# Altium schematic sheet TTLclock.SchDoc
size 558 x 431 mm; SheetNumber: 1; SheetTotal: 1
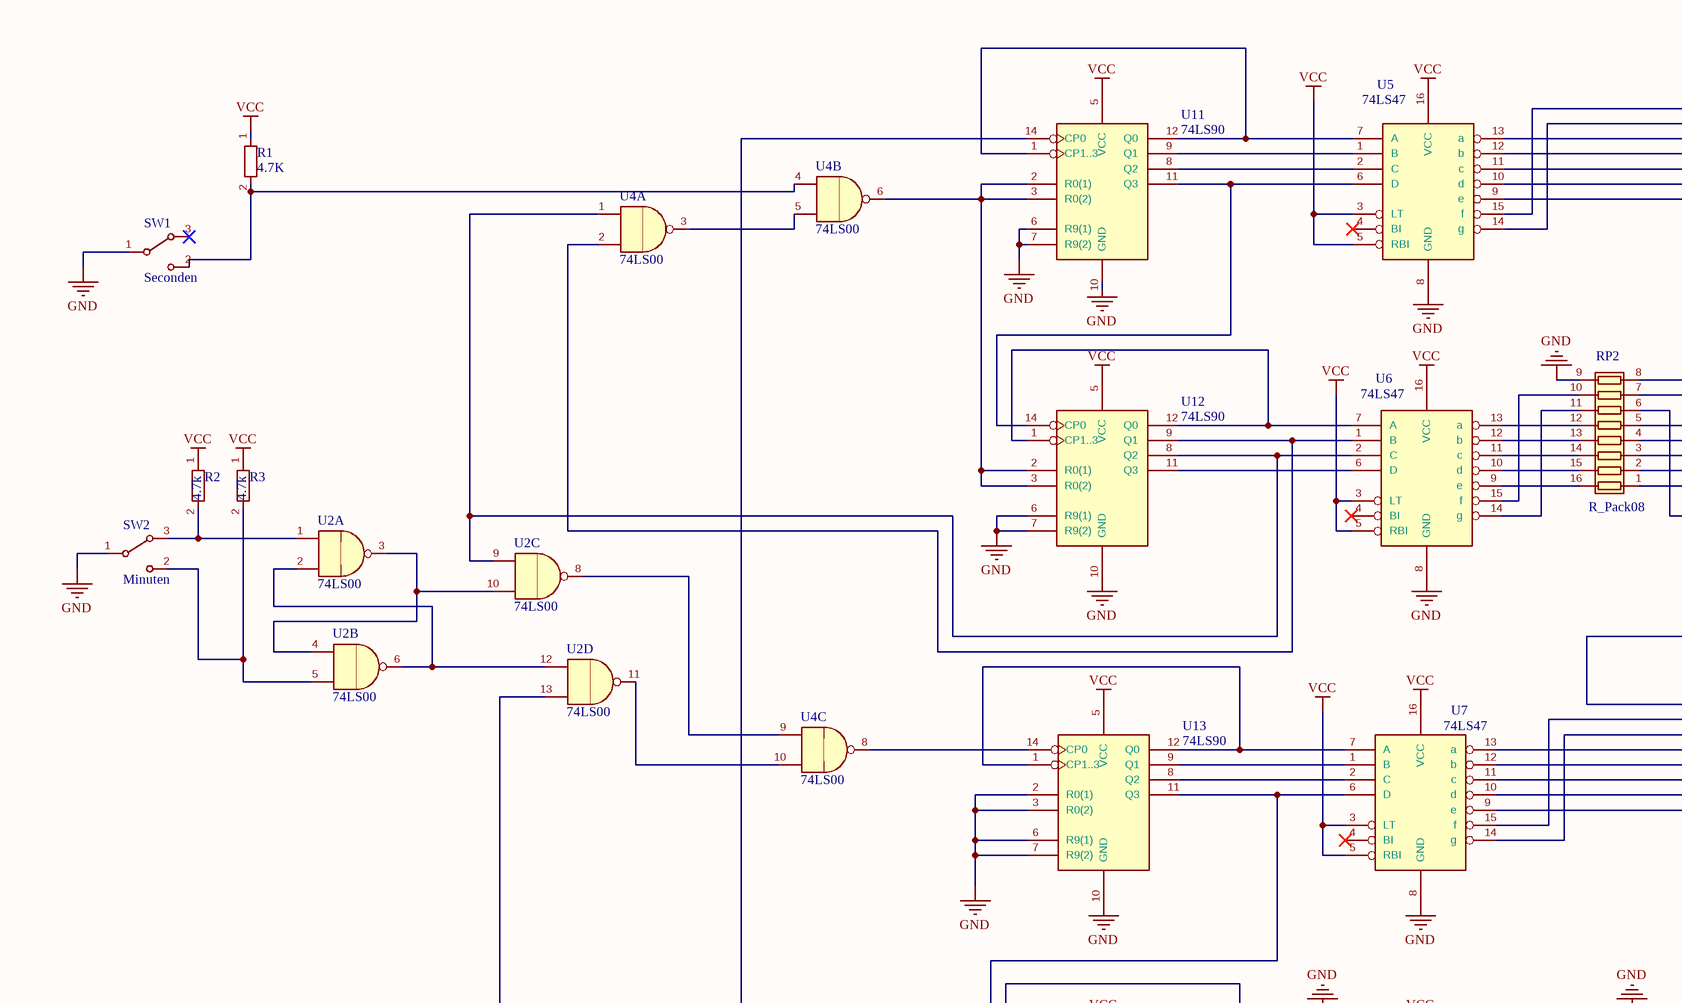
[diagram p0: TTLclock.SchDoc, top left]
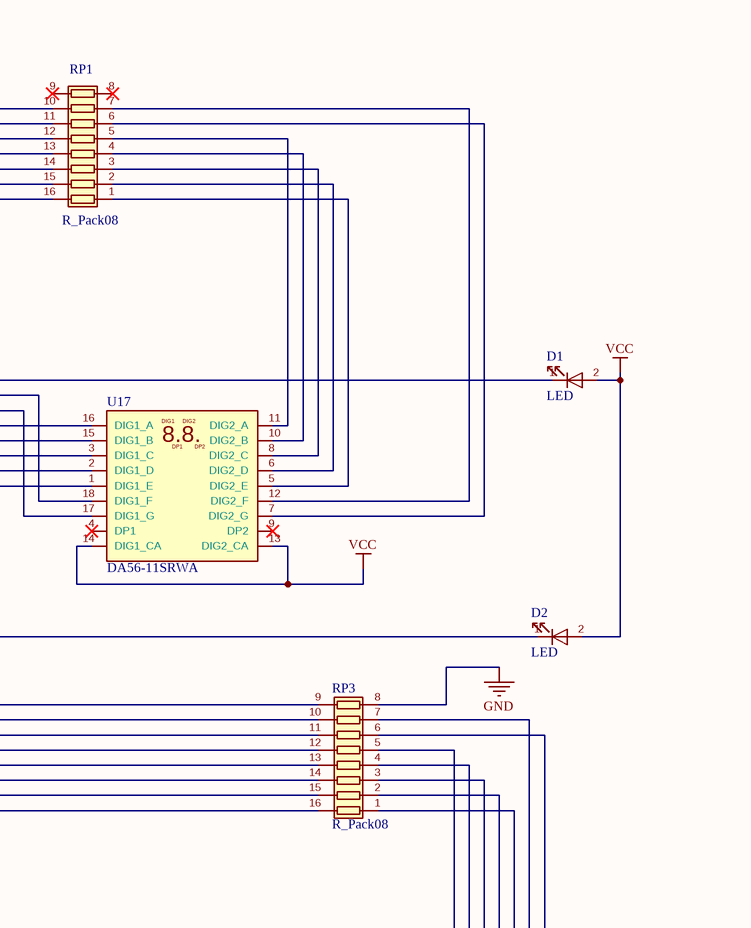
[diagram p1: TTLclock.SchDoc, top right]
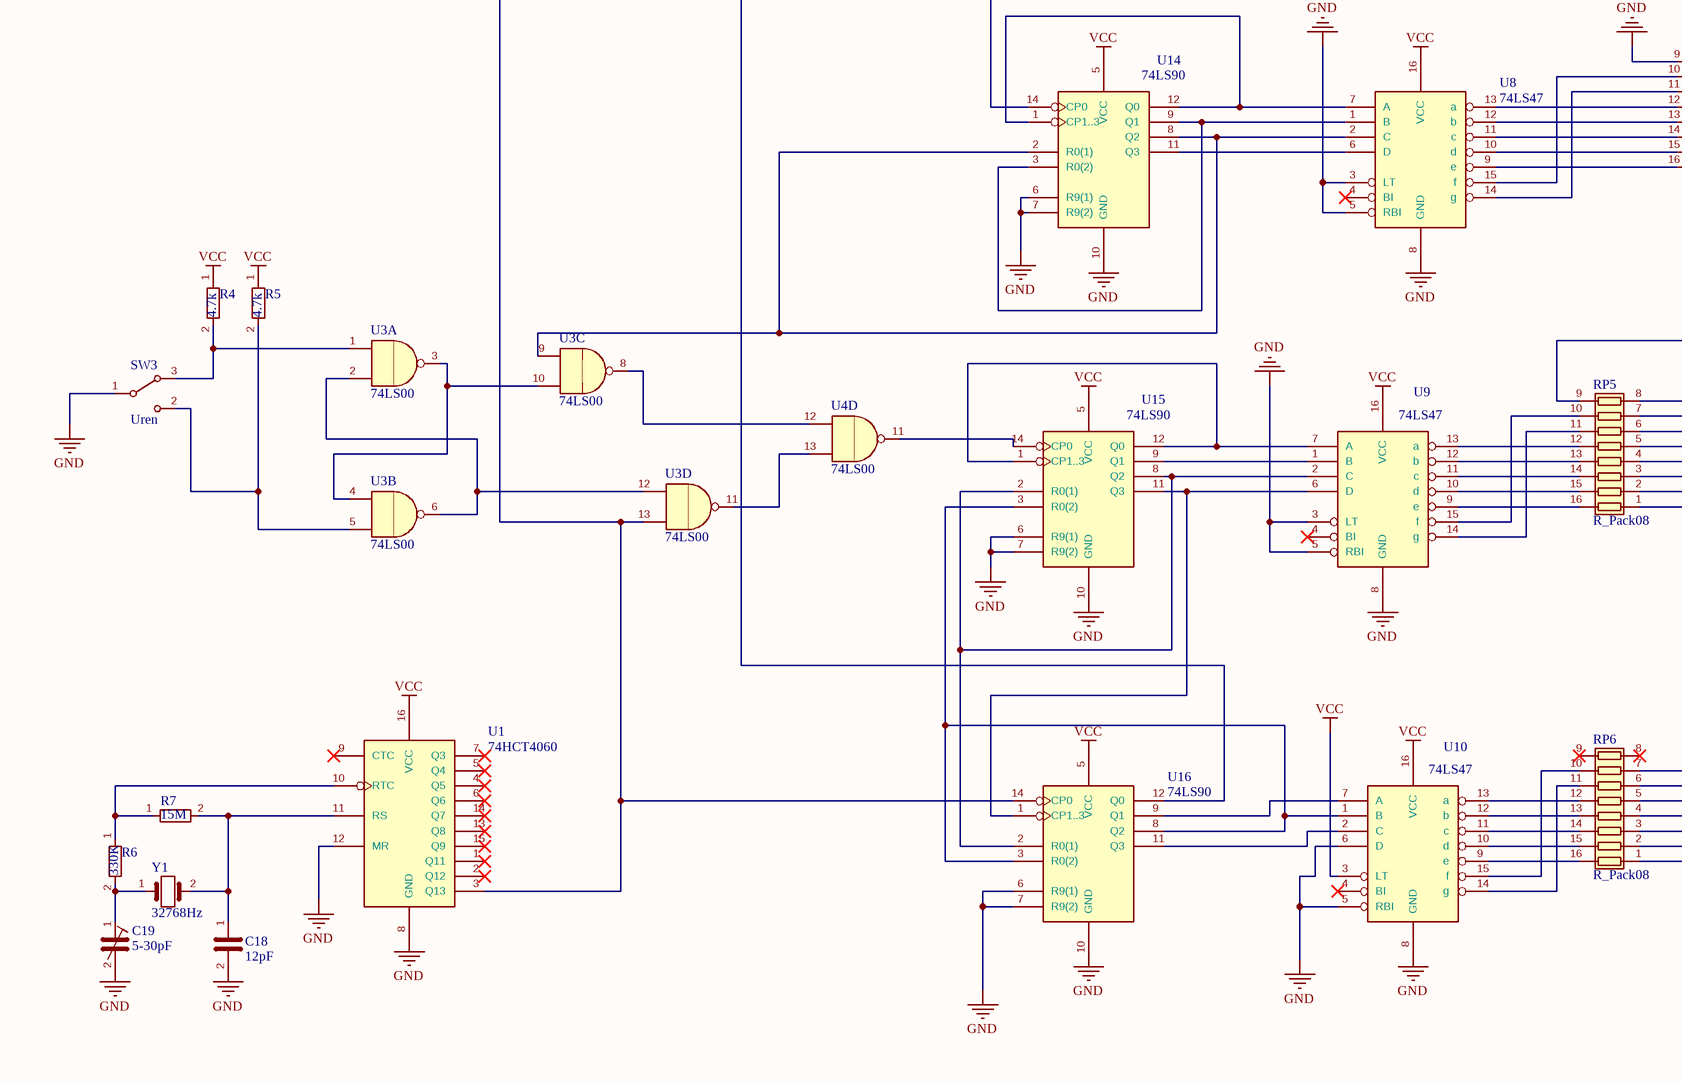
[diagram p2: TTLclock.SchDoc, bottom left]
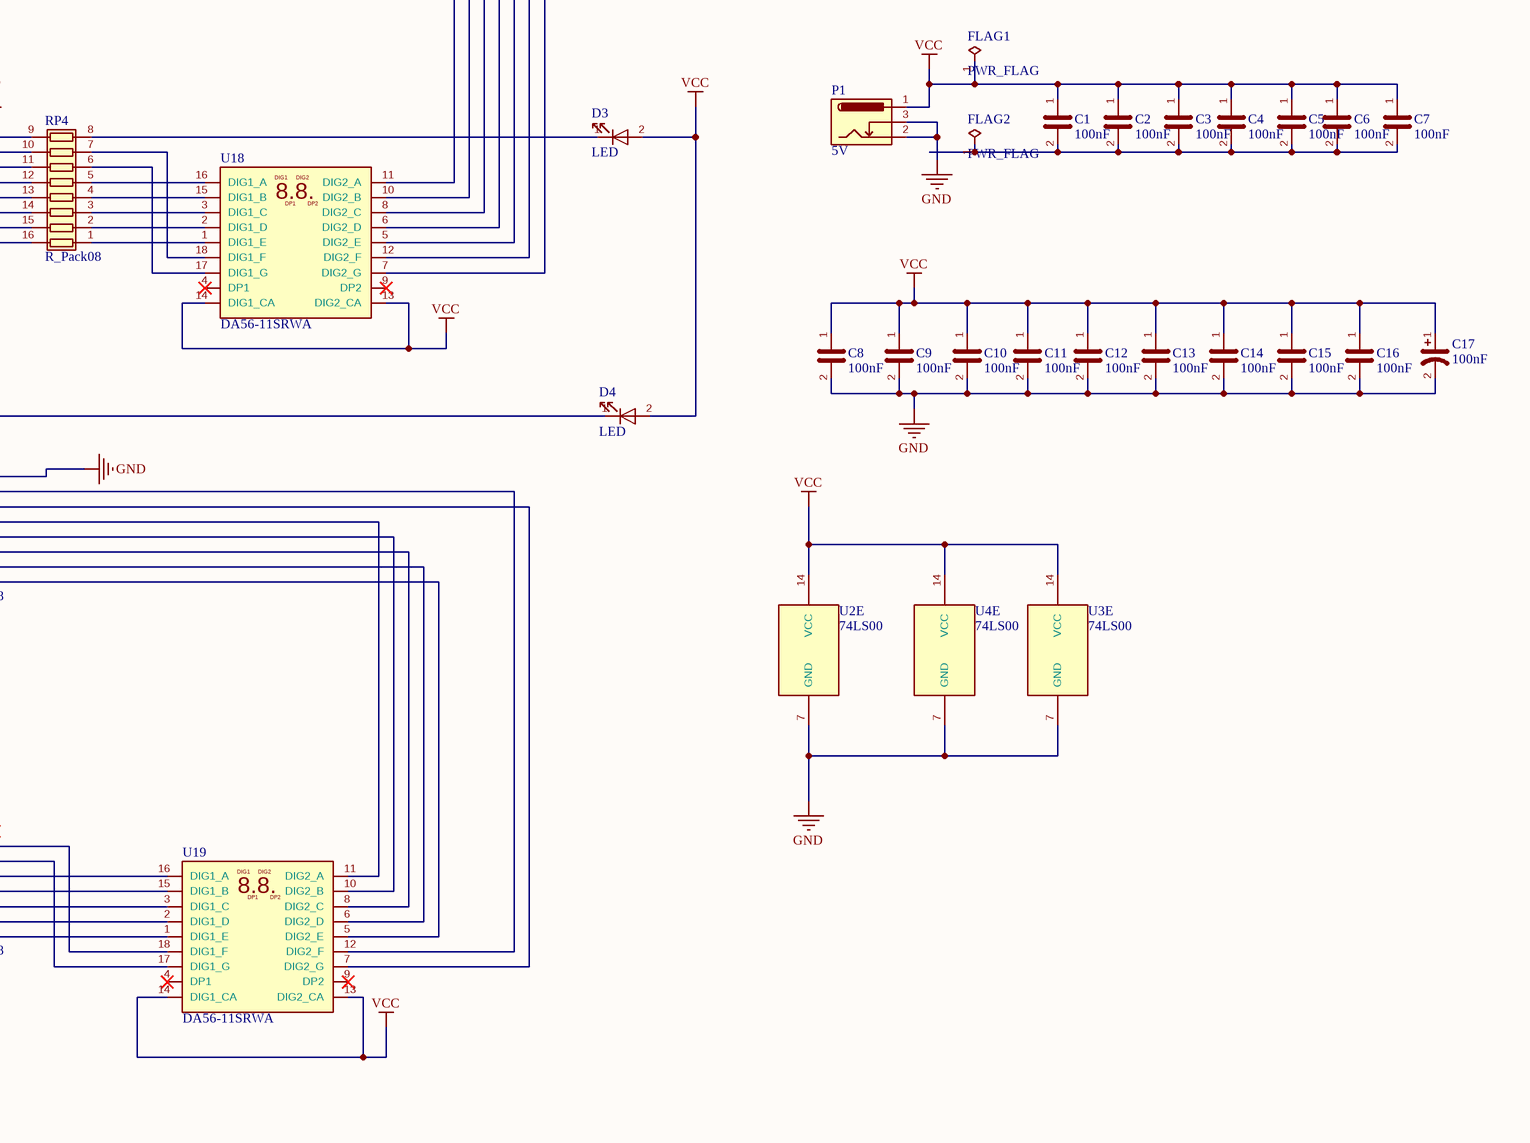
[diagram p3: TTLclock.SchDoc, bottom right]

## Parts
C1  100nF  [CAPPA1420W55L380D260]
C2  100nF  [CAPPA1420W55L380D260]
C3  100nF  [CAPPA1420W55L380D260]
C4  100nF  [CAPPA1420W55L380D260]
C5  100nF  [CAPPA1420W55L380D260]
C6  100nF  [CAPPA1420W55L380D260]
C7  100nF  [CAPPA1420W55L380D260]
C8  100nF  [CAPPA1420W55L380D260]
C9  100nF  [CAPPA1420W55L380D260]
C10  100nF  [CAPPA1420W55L380D260]
C11  100nF  [CAPPA1420W55L380D260]
C12  100nF  [CAPPA1420W55L380D260]
C13  100nF  [CAPPA1420W55L380D260]
C14  100nF  [CAPPA1420W55L380D260]
C15  100nF  [CAPPA1420W55L380D260]
C16  100nF  [CAPPA1420W55L380D260]
C17  100nF  [CAPPRD250W52D630H1250]
C18  12pF  [FG28]
C19  5-30pF  [JZ300]
D1  LED  [LED_SSL-LX4673GD-LA20]
D2  LED  [LED_SSL-LX4673GD-LA20]
D3  LED  [LED_SSL-LX4673GD-LA20]
D4  LED  [LED_SSL-LX4673GD-LA20]
FLAG1  PWR_FLAG  (graphical)
FLAG2  PWR_FLAG  (graphical)
P1  5V  [KLDX0202A]
R1  4.7K  [RESAD2870W80L1190D420]
R2  4.7k  [RESAD2870W80L1190D420]
R3  4.7k  [RESAD2870W80L1190D420]
R4  4.7k  [RESAD2870W80L1190D420]
R5  4.7k  [RESAD2870W80L1190D420]
R6  330K  [RESAD2870W80L1190D420]
R7  15M  [RESAD2870W80L1190D420]
RP1  R_Pack08  [DIP787W49P254L2197H469Q16N]
RP2  R_Pack08  [DIP787W49P254L2197H469Q16N]
RP3  R_Pack08  [DIP787W49P254L2197H469Q16N]
RP4  R_Pack08  [DIP787W49P254L2197H469Q16N]
RP5  R_Pack08  [DIP787W49P254L2197H469Q16N]
RP6  R_Pack08  [DIP787W49P254L2197H469Q16N]
SW1  Seconden  [SS0750301F040P1A]
SW2  Minuten  [SS0750301F040P1A]
SW3  Uren  [SS0750301F040P1A]
U1  74HCT4060  [DIP794W53P254L1930H508Q16N]
U2  74LS00  [DIP794W53P254L1930H508Q14N]  (parts A,B,C,D,E of 5)
U3  74LS00  [DIP794W53P254L1930H508Q14N]  (parts A,B,C,D,E of 5)
U4  74LS00  [DIP794W53P254L1930H508Q14N]  (parts A,B,C,D,E of 5)
U5  74LS47  [DIP794W53P254L1930H508Q16N]
U6  74LS47  [DIP794W53P254L1930H508Q16N]
U7  74LS47  [DIP794W53P254L1930H508Q16N]
U8  74LS47  [DIP794W53P254L1930H508Q16N]
U9  74LS47  [DIP794W53P254L1930H508Q16N]
U10  74LS47  [DIP794W53P254L1930H508Q16N]
U11  74LS90  [DIP794W53P254L1930H508Q14N]
U12  74LS90  [DIP794W53P254L1930H508Q14N]
U13  74LS90  [DIP794W53P254L1930H508Q14N]
U14  74LS90  [DIP794W53P254L1930H508Q14N]
U15  74LS90  [DIP794W53P254L1930H508Q14N]
U16  74LS90  [DIP794W53P254L1930H508Q14N]
U17  DA56-11SRWA  [DIPS1524W50P254L2500H825Q18N]
U18  DA56-11SRWA  [DIPS1524W50P254L2500H825Q18N]
U19  DA56-11SRWA  [DIPS1524W50P254L2500H825Q18N]
Y1  32768Hz  [XTAL_AB26T-32.768KHZ]

## Nets
GND: C8.2 C9.2 C10.2 C11.2 C12.2 C13.2 C14.2 C15.2 C16.2 C17.2 C18.2 C19.2 P1.2 P1.3 RP2.9(R8.2) RP3.8(R8.1) RP4.9(R8.2) RP5.8(R8.1) SW1.1(B) SW2.1(B) SW3.1(B) U1.8(GND) U1.12(MR) U2.7(GND) U3.7(GND) U4.7(GND) U5.8(GND) U6.8(GND) U7.8(GND) U8.3(LT) U8.5(RBI) U8.8(GND) U9.3(LT) U9.5(RBI) U9.8(GND) U10.5(RBI) U10.6(D) U10.8(GND) U11.6(R9(1)) U11.7(R9(2)) U11.10(GND) U12.6(R9(1)) U12.7(R9(2)) U12.10(GND) U13.2(R0(1)) U13.3(R0(2)) U13.6(R9(1)) U13.7(R9(2)) U13.10(GND) U14.6(R9(1)) U14.7(R9(2)) U14.10(GND) U15.6(R9(1)) U15.7(R9(2)) U15.10(GND) U16.6(R9(1)) U16.7(R9(2)) U16.10(GND)
VCC: C1.1 C2.1 C3.1 C4.1 C5.1 C6.1 C7.1 C8.1 C9.1 C10.1 C11.1 C12.1 C13.1 C14.1 C15.1 C16.1 C17.1 D1.2(A) D2.2(A) D3.2(A) D4.2(A) FLAG1.1(pwr) P1.1 R1.1 R2.1 R3.1 R4.1 R5.1 U1.16(VCC) U2.14(VCC) U3.14(VCC) U4.14(VCC) U5.3(LT) U5.5(RBI) U5.16(VCC) U6.3(LT) U6.5(RBI) U6.16(VCC) U7.3(LT) U7.5(RBI) U7.16(VCC) U8.16(VCC) U9.16(VCC) U10.3(LT) U10.16(VCC) U11.5(VCC) U12.5(VCC) U13.5(VCC) U14.5(VCC) U15.5(VCC) U16.5(VCC) U17.13(DIG2_CA) U17.14(DIG1_CA) U18.13(DIG2_CA) U18.14(DIG1_CA) U19.13(DIG2_CA) U19.14(DIG1_CA)
NetC1_2: C1.2 C2.2 C3.2 C4.2 C5.2 C6.2 C7.2 FLAG2.1(pwr)
NetC18_1: C18.1 R7.2 U1.11(RS) Y1.2
NetC19_1: C19.1 R6.2 Y1.1
NetD1_1: D1.1(K) RP2.8(R8.1)
NetD2_1: D2.1(K) RP3.9(R8.2)
NetD3_1: D3.1(K) RP4.8(R8.1)
NetD4_1: D4.1(K) RP5.9(R8.2)
NetR1_2: R1.2 SW1.2(C) U4.4
NetR2_2: R2.2 SW2.3(A) U2.1
NetR3_2: R3.2 SW2.2(C) U2.5
NetR4_2: R4.2 SW3.3(A) U3.1
NetR5_2: R5.2 SW3.2(C) U3.5
NetR6_1: R6.1 R7.1 U1.10(RTC)
NetRP1_1: RP1.1(R1.1) U17.5(DIG2_E)
NetRP1_2: RP1.2(R2.1) U17.6(DIG2_D)
NetRP1_3: RP1.3(R3.1) U17.8(DIG2_C)
NetRP1_4: RP1.4(R4.1) U17.10(DIG2_B)
NetRP1_5: RP1.5(R5.1) U17.11(DIG2_A)
NetRP1_6: RP1.6(R6.1) U17.7(DIG2_G)
NetRP1_7: RP1.7(R7.1) U17.12(DIG2_F)
NetRP1_10: RP1.10(R7.2) U5.15(f)
NetRP1_11: RP1.11(R6.2) U5.14(g)
NetRP1_12: RP1.12(R5.2) U5.13(a)
NetRP1_13: RP1.13(R4.2) U5.12(b)
NetRP1_14: RP1.14(R3.2) U5.11(c)
NetRP1_15: RP1.15(R2.2) U5.10(d)
NetRP1_16: RP1.16(R1.2) U5.9(e)
NetRP2_1: RP2.1(R1.1) U17.1(DIG1_E)
NetRP2_2: RP2.2(R2.1) U17.2(DIG1_D)
NetRP2_3: RP2.3(R3.1) U17.3(DIG1_C)
NetRP2_4: RP2.4(R4.1) U17.15(DIG1_B)
NetRP2_5: RP2.5(R5.1) U17.16(DIG1_A)
NetRP2_6: RP2.6(R6.1) U17.17(DIG1_G)
NetRP2_7: RP2.7(R7.1) U17.18(DIG1_F)
NetRP2_10: RP2.10(R7.2) U6.15(f)
NetRP2_11: RP2.11(R6.2) U6.14(g)
NetRP2_12: RP2.12(R5.2) U6.13(a)
NetRP2_13: RP2.13(R4.2) U6.12(b)
NetRP2_14: RP2.14(R3.2) U6.11(c)
NetRP2_15: RP2.15(R2.2) U6.10(d)
NetRP2_16: RP2.16(R1.2) U6.9(e)
NetRP3_1: RP3.1(R1.1) U18.5(DIG2_E)
NetRP3_2: RP3.2(R2.1) U18.6(DIG2_D)
NetRP3_3: RP3.3(R3.1) U18.8(DIG2_C)
NetRP3_4: RP3.4(R4.1) U18.10(DIG2_B)
NetRP3_5: RP3.5(R5.1) U18.11(DIG2_A)
NetRP3_6: RP3.6(R6.1) U18.7(DIG2_G)
NetRP3_7: RP3.7(R7.1) U18.12(DIG2_F)
NetRP3_10: RP3.10(R7.2) U7.15(f)
NetRP3_11: RP3.11(R6.2) U7.14(g)
NetRP3_12: RP3.12(R5.2) U7.13(a)
NetRP3_13: RP3.13(R4.2) U7.12(b)
NetRP3_14: RP3.14(R3.2) U7.11(c)
NetRP3_15: RP3.15(R2.2) U7.10(d)
NetRP3_16: RP3.16(R1.2) U7.9(e)
NetRP4_1: RP4.1(R1.1) U18.1(DIG1_E)
NetRP4_2: RP4.2(R2.1) U18.2(DIG1_D)
NetRP4_3: RP4.3(R3.1) U18.3(DIG1_C)
NetRP4_4: RP4.4(R4.1) U18.15(DIG1_B)
NetRP4_5: RP4.5(R5.1) U18.16(DIG1_A)
NetRP4_6: RP4.6(R6.1) U18.17(DIG1_G)
NetRP4_7: RP4.7(R7.1) U18.18(DIG1_F)
NetRP4_10: RP4.10(R7.2) U8.15(f)
NetRP4_11: RP4.11(R6.2) U8.14(g)
NetRP4_12: RP4.12(R5.2) U8.13(a)
NetRP4_13: RP4.13(R4.2) U8.12(b)
NetRP4_14: RP4.14(R3.2) U8.11(c)
NetRP4_15: RP4.15(R2.2) U8.10(d)
NetRP4_16: RP4.16(R1.2) U8.9(e)
NetRP5_1: RP5.1(R1.1) U19.5(DIG2_E)
NetRP5_2: RP5.2(R2.1) U19.6(DIG2_D)
NetRP5_3: RP5.3(R3.1) U19.8(DIG2_C)
NetRP5_4: RP5.4(R4.1) U19.10(DIG2_B)
NetRP5_5: RP5.5(R5.1) U19.11(DIG2_A)
NetRP5_6: RP5.6(R6.1) U19.7(DIG2_G)
NetRP5_7: RP5.7(R7.1) U19.12(DIG2_F)
NetRP5_10: RP5.10(R7.2) U9.15(f)
NetRP5_11: RP5.11(R6.2) U9.14(g)
NetRP5_12: RP5.12(R5.2) U9.13(a)
NetRP5_13: RP5.13(R4.2) U9.12(b)
NetRP5_14: RP5.14(R3.2) U9.11(c)
NetRP5_15: RP5.15(R2.2) U9.10(d)
NetRP5_16: RP5.16(R1.2) U9.9(e)
NetRP6_1: RP6.1(R1.1) U19.1(DIG1_E)
NetRP6_2: RP6.2(R2.1) U19.2(DIG1_D)
NetRP6_3: RP6.3(R3.1) U19.3(DIG1_C)
NetRP6_4: RP6.4(R4.1) U19.15(DIG1_B)
NetRP6_5: RP6.5(R5.1) U19.16(DIG1_A)
NetRP6_6: RP6.6(R6.1) U19.17(DIG1_G)
NetRP6_7: RP6.7(R7.1) U19.18(DIG1_F)
NetRP6_10: RP6.10(R7.2) U10.15(f)
NetRP6_11: RP6.11(R6.2) U10.14(g)
NetRP6_12: RP6.12(R5.2) U10.13(a)
NetRP6_13: RP6.13(R4.2) U10.12(b)
NetRP6_14: RP6.14(R3.2) U10.11(c)
NetRP6_15: RP6.15(R2.2) U10.10(d)
NetRP6_16: RP6.16(R1.2) U10.9(e)
NetU1_3: U1.3(Q13) U2.13 U3.13 U16.14(CP0)
NetU2_2: U2.2 U2.6 U2.12
NetU2_3: U2.3 U2.4 U2.10
NetU2_8: U2.8 U4.9
NetU2_9: U2.9 U4.1 U6.2(C) U12.8(Q2)
NetU2_11: U2.11 U4.10
NetU3_2: U3.2 U3.6 U3.12
NetU3_3: U3.3 U3.4 U3.10
NetU3_8: U3.8 U4.12
NetU3_9: U3.9 U8.2(C) U14.2(R0(1)) U14.8(Q2)
NetU3_11: U3.11 U4.13
NetU4_2: U4.2 U6.1(B) U12.9(Q1)
NetU4_3: U4.3 U4.5
NetU4_6: U4.6 U11.2(R0(1)) U11.3(R0(2)) U12.2(R0(1)) U12.3(R0(2))
NetU4_8: U4.8 U13.14(CP0)
NetU4_11: U4.11 U15.14(CP0)
NetU5_1: U5.1(B) U11.9(Q1)
NetU5_2: U5.2(C) U11.8(Q2)
NetU5_6: U5.6(D) U11.11(Q3) U12.14(CP0)
NetU5_7: U5.7(A) U11.1(CP1..3) U11.12(Q0)
NetU6_6: U6.6(D) U12.11(Q3)
NetU6_7: U6.7(A) U12.1(CP1..3) U12.12(Q0)
NetU7_1: U7.1(B) U13.9(Q1)
NetU7_2: U7.2(C) U13.8(Q2)
NetU7_6: U7.6(D) U13.11(Q3) U14.14(CP0)
NetU7_7: U7.7(A) U13.1(CP1..3) U13.12(Q0)
NetU8_1: U8.1(B) U14.3(R0(2)) U14.9(Q1)
NetU8_6: U8.6(D) U14.11(Q3)
NetU8_7: U8.7(A) U14.1(CP1..3) U14.12(Q0)
NetU9_1: U9.1(B) U15.9(Q1)
NetU9_2: U9.2(C) U15.2(R0(1)) U15.8(Q2) U16.2(R0(1))
NetU9_6: U9.6(D) U15.11(Q3) U16.1(CP1..3)
NetU9_7: U9.7(A) U15.1(CP1..3) U15.12(Q0)
NetU10_1: U10.1(B) U15.3(R0(2)) U16.3(R0(2)) U16.8(Q2)
NetU10_2: U10.2(C) U16.11(Q3)
NetU10_7: U10.7(A) U16.9(Q1)
NetU11_14: U11.14(CP0) U16.12(Q0)

Not connected (* = marked no-connect by the designer): RP1 8(R8.1)* 9(R8.2)*; RP6 8(R8.1)* 9(R8.2)*; SW1 3(A)*; U1 1(Q11)* 2(Q12)* 4(Q5)* 5(Q4)* 6(Q6)* 7(Q3)* 9(CTC)* 13(Q8)* 14(Q7)* 15(Q9)*; U5 4(BI)*; U6 4(BI)*; U7 4(BI)*; U8 4(BI)*; U9 4(BI)*; U10 4(BI)*; U17 4(DP1)* 9(DP2)*; U18 4(DP1)* 9(DP2)*; U19 4(DP1)* 9(DP2)*

## Notes on the sheet
- DWG. NO.
- REV.
- SHT.
- REVISION
- DESCRIPTION
- DATE
- APPROVED
- THIS DOCUMENT AND THE DATA DISCLOSED HEREIN OR HEREWITH IS THE PROPERTY OF ALTIUM LIMITED AND MAY BE FREELY DISTRIBUTED IN WHOLE. NO RIGHTS ARE RESERVED OR EXPRESS OR IMPLIED WARANTEE GIVEN.
- ENG:
- DSN:
- APPROVALS
- PROJECT
- DOCUMENT REVISION:
- DESIGN ITEM:
- CHK:
- BOM:
- REFERENCE DOCUMENTS
- PROJECT REVISION:
- TITLE
- FAB DWG:
- PCB DWG:
- ASSY DWG:
- SCALE:
- SIZE
- C
- CAGE CODE
- FILE NAME
- DWG NO.
- SHEET
- OF
- REV
- (in symbol DA56-11SRWA) DIG1; DIG2; 8.8.

## Library data of the parts
C1-C16 C18 = C
C17 = CP1
C19 = CTRIM
P1 = Barrel_Jack_Switch
R1-R7 = R
SW1-SW3 = SW_SPDT_Omron
Y1 = Crystal